# Altium schematic sheet TLS-01.SchDoc
size A4
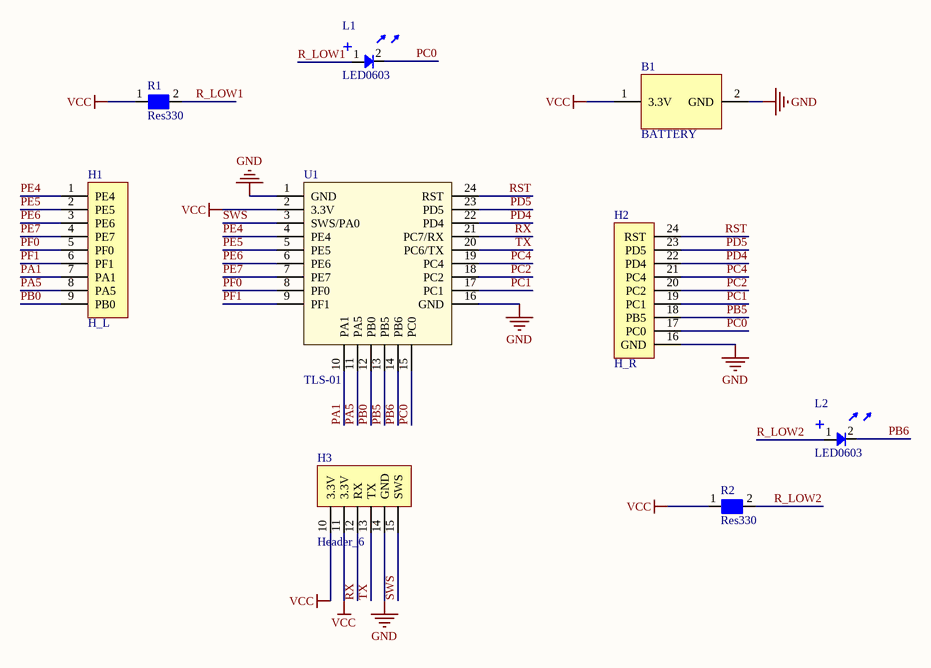
[diagram p0: TLS-01.SchDoc]

## Parts
B1  BATTERY  [PCBComponent_1]
H1  H_L  [L]
H2  H_R  [R]
H3  Header_6  [D]
L1  LED0603  [LED0603]
L2  LED0603  [LED0603]
R1  Res330  [Res0603]
R2  Res330  [Res0603]
U1  TLS-01  [TLS-01]

## Nets
GND: B1.2(GND) H2.16(GND) H3.14(GND) U1.1(GND) U1.16(GND)
VCC: B1.1(3.3V) H3.10(3.3V) H3.11(3.3V) R1.1 R2.1 U1.2(3.3V)
PA1: H1.7(PA1) U1.10(PA1)
PA5: H1.8(PA5) U1.11(PA5)
PB0: H1.9(PB0) U1.12(PB0)
PB5: H2.18(PB5) U1.13(PB5)
PB6: L2.2(-) U1.14(PB6)
PC0: H2.17(PC0) L1.2(-) U1.15(PC0)
PC1: H2.19(PC1) U1.17(PC1)
PC2: H2.20(PC2) U1.18(PC2)
PC4: H2.21(PC4) U1.19(PC4)
PD4: H2.22(PD4) U1.22(PD4)
PD5: H2.23(PD5) U1.23(PD5)
PE4: H1.1(PE4) U1.4(PE4)
PE5: H1.2(PE5) U1.5(PE5)
PE6: H1.3(PE6) U1.6(PE6)
PE7: H1.4(PE7) U1.7(PE7)
PF0: H1.5(PF0) U1.8(PF0)
PF1: H1.6(PF1) U1.9(PF1)
R_LOW1: L1.1(+) R1.2
R_LOW2: L2.1(+) R2.2
RST: H2.24(RST) U1.24(RST)
RX: H3.12(RX) U1.21(PC7/RX)
SWS: H3.15(SWS) U1.3(SWS/PA0)
TX: H3.13(TX) U1.20(PC6/TX)

## Library data of the parts
H3 = Header_L
R1 R2 = Res0603